# Altium project PLC光电隔离模块NPN-16路.PrjPcb
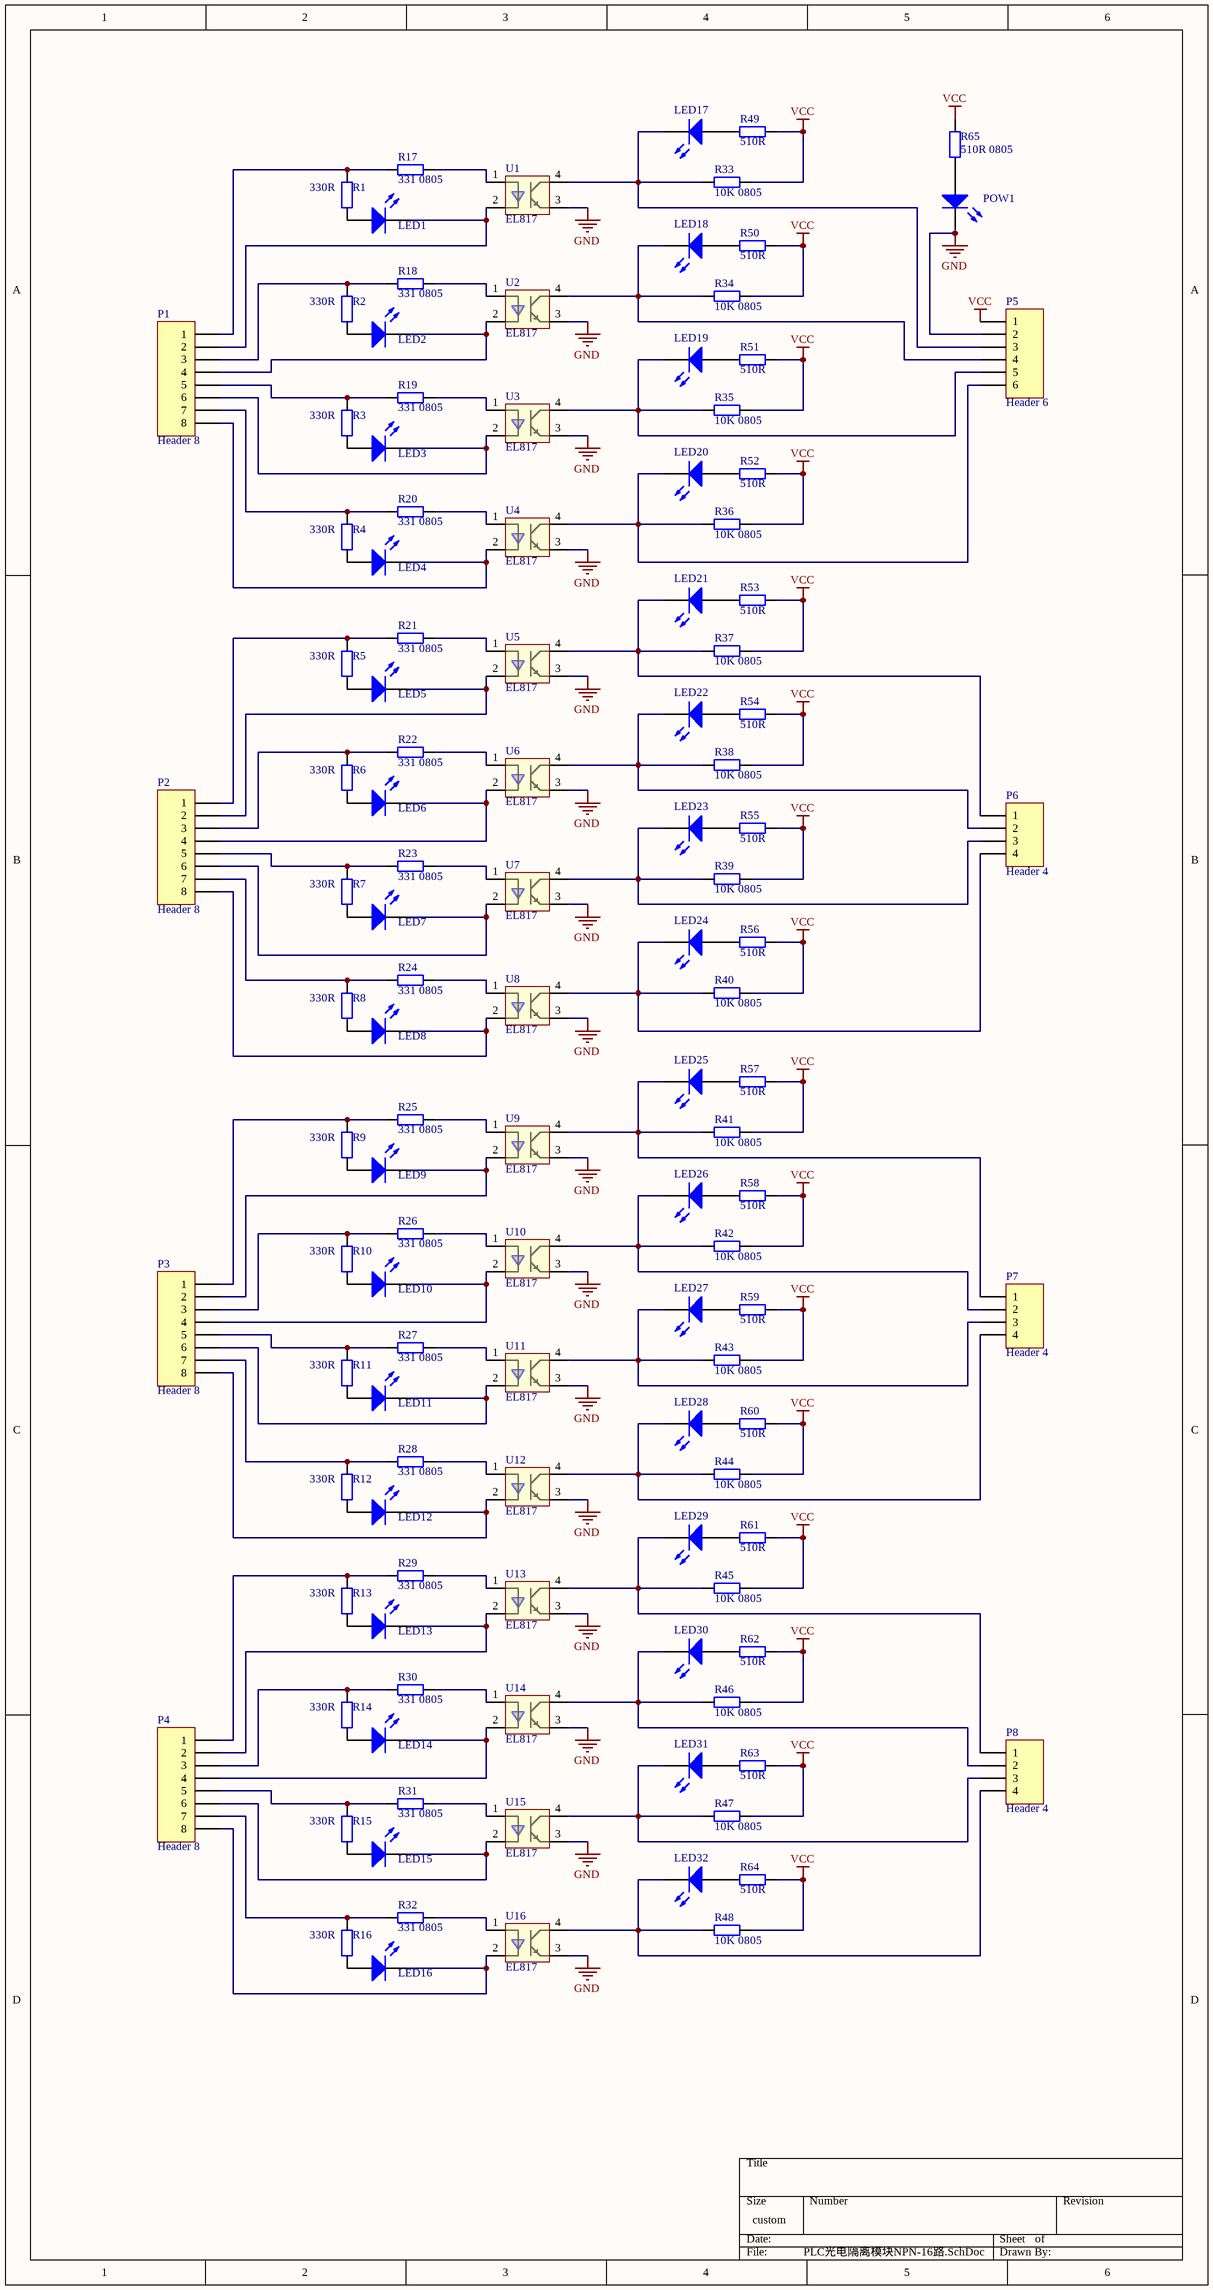
[diagram p0: PLC光电隔离模块NPN-16路.SchDoc]
1 sheet, 122 parts. Net scope: global (net labels, ports and power ports of the same name join across sheets).
Board file: PLC光电隔离模块NPN-16路.PcbDoc

## Sheet PLC光电隔离模块NPN-16路.SchDoc
size 241 x 457 mm

### Parts
LED1  0805  [LC-0805]  (value not drawn)
LED2  0805  [LC-0805]  (value not drawn)
LED3  0805  [LC-0805]  (value not drawn)
LED4  0805  [LC-0805]  (value not drawn)
LED5  0805  [LC-0805]  (value not drawn)
LED6  0805  [LC-0805]  (value not drawn)
LED7  0805  [LC-0805]  (value not drawn)
LED8  0805  [LC-0805]  (value not drawn)
LED9  0805  [LC-0805]  (value not drawn)
LED10  0805  [LC-0805]  (value not drawn)
LED11  0805  [LC-0805]  (value not drawn)
LED12  0805  [LC-0805]  (value not drawn)
LED13  0805  [LC-0805]  (value not drawn)
LED14  0805  [LC-0805]  (value not drawn)
LED15  0805  [LC-0805]  (value not drawn)
LED16  0805  [LC-0805]  (value not drawn)
LED17  0805  [LC-0805]  (value not drawn)
LED18  0805  [LC-0805]  (value not drawn)
LED19  0805  [LC-0805]  (value not drawn)
LED20  0805  [LC-0805]  (value not drawn)
LED21  0805  [LC-0805]  (value not drawn)
LED22  0805  [LC-0805]  (value not drawn)
LED23  0805  [LC-0805]  (value not drawn)
LED24  0805  [LC-0805]  (value not drawn)
LED25  0805  [LC-0805]  (value not drawn)
LED26  0805  [LC-0805]  (value not drawn)
LED27  0805  [LC-0805]  (value not drawn)
LED28  0805  [LC-0805]  (value not drawn)
LED29  0805  [LC-0805]  (value not drawn)
LED30  0805  [LC-0805]  (value not drawn)
LED31  0805  [LC-0805]  (value not drawn)
LED32  0805  [LC-0805]  (value not drawn)
P1  Header 8  [128单排8位端子5.08]
P2  Header 8  [128单排8位端子5.08]
P3  Header 8  [128单排8位端子5.08]
P4  Header 8  [128单排8位端子5.08]
P5  Header 6  [128单排6位端子5.08 - 反向]
P6  Header 4  [128单排4位端子5.08]
P7  Header 4  [128单排4位端子5.08]
P8  Header 4  [128单排4位端子5.08]
POW1  0805  [LC-0805]  (value not drawn)
R1  330R  [LC-0805_L]
R2  330R  [LC-0805_L]
R3  330R  [LC-0805_L]
R4  330R  [LC-0805_L]
R5  330R  [LC-0805_L]
R6  330R  [LC-0805_L]
R7  330R  [LC-0805_L]
R8  330R  [LC-0805_L]
R9  330R  [LC-0805_L]
R10  330R  [LC-0805_L]
R11  330R  [LC-0805_L]
R12  330R  [LC-0805_L]
R13  330R  [LC-0805_L]
R14  330R  [LC-0805_L]
R15  330R  [LC-0805_L]
R16  330R  [LC-0805_L]
R17  331 0805  [LC-0805_L]
R18  331 0805  [LC-0805_L]
R19  331 0805  [LC-0805_L]
R20  331 0805  [LC-0805_L]
R21  331 0805  [LC-0805_L]
R22  331 0805  [LC-0805_L]
R23  331 0805  [LC-0805_L]
R24  331 0805  [LC-0805_L]
R25  331 0805  [LC-0805_L]
R26  331 0805  [LC-0805_L]
R27  331 0805  [LC-0805_L]
R28  331 0805  [LC-0805_L]
R29  331 0805  [LC-0805_L]
R30  331 0805  [LC-0805_L]
R31  331 0805  [LC-0805_L]
R32  331 0805  [LC-0805_L]
R33  10K 0805  [LC-0805_L]
R34  10K 0805  [LC-0805_L]
R35  10K 0805  [LC-0805_L]
R36  10K 0805  [LC-0805_L]
R37  10K 0805  [LC-0805_L]
R38  10K 0805  [LC-0805_L]
R39  10K 0805  [LC-0805_L]
R40  10K 0805  [LC-0805_L]
R41  10K 0805  [LC-0805_L]
R42  10K 0805  [LC-0805_L]
R43  10K 0805  [LC-0805_L]
R44  10K 0805  [LC-0805_L]
R45  10K 0805  [LC-0805_L]
R46  10K 0805  [LC-0805_L]
R47  10K 0805  [LC-0805_L]
R48  10K 0805  [LC-0805_L]
R49  510R  [LC-0805_L]
R50  510R  [LC-0805_L]
R51  510R  [LC-0805_L]
R52  510R  [LC-0805_L]
R53  510R  [LC-0805_L]
R54  510R  [LC-0805_L]
R55  510R  [LC-0805_L]
R56  510R  [LC-0805_L]
R57  510R  [LC-0805_L]
R58  510R  [LC-0805_L]
R59  510R  [LC-0805_L]
R60  510R  [LC-0805_L]
R61  510R  [LC-0805_L]
R62  510R  [LC-0805_L]
R63  510R  [LC-0805_L]
R64  510R  [LC-0805_L]
R65  510R 0805  [LC-0805_L]
U1  EL817  [EL817]
U2  EL817  [EL817]
U3  EL817  [EL817]
U4  EL817  [EL817]
U5  EL817  [EL817]
U6  EL817  [EL817]
U7  EL817  [EL817]
U8  EL817  [EL817]
U9  EL817  [EL817]
U10  EL817  [EL817]
U11  EL817  [EL817]
U12  EL817  [EL817]
U13  EL817  [EL817]
U14  EL817  [EL817]
U15  EL817  [EL817]
U16  EL817  [EL817]

### Nets
GND: P5.2 POW1.2(K) U1.3 U2.3 U3.3 U4.3 U5.3 U6.3 U7.3 U8.3 U9.3 U10.3 U11.3 U12.3 U13.3 U14.3 U15.3 U16.3
VCC: P5.1 R33.2 R34.2 R35.2 R36.2 R37.2 R38.2 R39.2 R40.2 R41.2 R42.2 R43.2 R44.2 R45.2 R46.2 R47.2 R48.2 R49.1 R50.1 R51.1 R52.1 R53.1 R54.1 R55.1 R56.1 R57.1 R58.1 R59.1 R60.1 R61.1 R62.1 R63.1 R64.1 R65.2
NetLED1_1: LED1.1(A) R1.1
NetLED1_2: LED1.2(K) P1.2 U1.2
NetLED2_1: LED2.1(A) R2.1
NetLED2_2: LED2.2(K) P1.4 U2.2
NetLED3_1: LED3.1(A) R3.1
NetLED3_2: LED3.2(K) P1.6 U3.2
NetLED4_1: LED4.1(A) R4.1
NetLED4_2: LED4.2(K) P1.8 U4.2
NetLED5_1: LED5.1(A) R5.1
NetLED5_2: LED5.2(K) P2.2 U5.2
NetLED6_1: LED6.1(A) R6.1
NetLED6_2: LED6.2(K) P2.4 U6.2
NetLED7_1: LED7.1(A) R7.1
NetLED7_2: LED7.2(K) P2.6 U7.2
NetLED8_1: LED8.1(A) R8.1
NetLED8_2: LED8.2(K) P2.8 U8.2
NetLED9_1: LED9.1(A) R9.1
NetLED9_2: LED9.2(K) P3.2 U9.2
NetLED10_1: LED10.1(A) R10.1
NetLED10_2: LED10.2(K) P3.4 U10.2
NetLED11_1: LED11.1(A) R11.1
NetLED11_2: LED11.2(K) P3.6 U11.2
NetLED12_1: LED12.1(A) R12.1
NetLED12_2: LED12.2(K) P3.8 U12.2
NetLED13_1: LED13.1(A) R13.1
NetLED13_2: LED13.2(K) P4.2 U13.2
NetLED14_1: LED14.1(A) R14.1
NetLED14_2: LED14.2(K) P4.4 U14.2
NetLED15_1: LED15.1(A) R15.1
NetLED15_2: LED15.2(K) P4.6 U15.2
NetLED16_1: LED16.1(A) R16.1
NetLED16_2: LED16.2(K) P4.8 U16.2
NetLED17_1: LED17.1(A) R49.2
NetLED17_2: LED17.2(K) P5.3 R33.1 U1.4
NetLED18_1: LED18.1(A) R50.2
NetLED18_2: LED18.2(K) P5.4 R34.1 U2.4
NetLED19_1: LED19.1(A) R51.2
NetLED19_2: LED19.2(K) P5.5 R35.1 U3.4
NetLED20_1: LED20.1(A) R52.2
NetLED20_2: LED20.2(K) P5.6 R36.1 U4.4
NetLED21_1: LED21.1(A) R53.2
NetLED21_2: LED21.2(K) P6.1 R37.1 U5.4
NetLED22_1: LED22.1(A) R54.2
NetLED22_2: LED22.2(K) P6.2 R38.1 U6.4
NetLED23_1: LED23.1(A) R55.2
NetLED23_2: LED23.2(K) P6.3 R39.1 U7.4
NetLED24_1: LED24.1(A) R56.2
NetLED24_2: LED24.2(K) P6.4 R40.1 U8.4
NetLED25_1: LED25.1(A) R57.2
NetLED25_2: LED25.2(K) P7.1 R41.1 U9.4
NetLED26_1: LED26.1(A) R58.2
NetLED26_2: LED26.2(K) P7.2 R42.1 U10.4
NetLED27_1: LED27.1(A) R59.2
NetLED27_2: LED27.2(K) P7.3 R43.1 U11.4
NetLED28_1: LED28.1(A) R60.2
NetLED28_2: LED28.2(K) P7.4 R44.1 U12.4
NetLED29_1: LED29.1(A) R61.2
NetLED29_2: LED29.2(K) P8.1 R45.1 U13.4
NetLED30_1: LED30.1(A) R62.2
NetLED30_2: LED30.2(K) P8.2 R46.1 U14.4
NetLED31_1: LED31.1(A) R63.2
NetLED31_2: LED31.2(K) P8.3 R47.1 U15.4
NetLED32_1: LED32.1(A) R64.2
NetLED32_2: LED32.2(K) P8.4 R48.1 U16.4
NetP1_1: P1.1 R1.2 R17.1
NetP1_3: P1.3 R2.2 R18.1
NetP1_5: P1.5 R3.2 R19.1
NetP1_7: P1.7 R4.2 R20.1
NetP2_1: P2.1 R5.2 R21.1
NetP2_3: P2.3 R6.2 R22.1
NetP2_5: P2.5 R7.2 R23.1
NetP2_7: P2.7 R8.2 R24.1
NetP3_1: P3.1 R9.2 R25.1
NetP3_3: P3.3 R10.2 R26.1
NetP3_5: P3.5 R11.2 R27.1
NetP3_7: P3.7 R12.2 R28.1
NetP4_1: P4.1 R13.2 R29.1
NetP4_3: P4.3 R14.2 R30.1
NetP4_5: P4.5 R15.2 R31.1
NetP4_7: P4.7 R16.2 R32.1
NetPOW1_1: POW1.1(A) R65.1
NetR17_2: R17.2 U1.1
NetR18_2: R18.2 U2.1
NetR19_2: R19.2 U3.1
NetR20_2: R20.2 U4.1
NetR21_2: R21.2 U5.1
NetR22_2: R22.2 U6.1
NetR23_2: R23.2 U7.1
NetR24_2: R24.2 U8.1
NetR25_2: R25.2 U9.1
NetR26_2: R26.2 U10.1
NetR27_2: R27.2 U11.1
NetR28_2: R28.2 U12.1
NetR29_2: R29.2 U13.1
NetR30_2: R30.2 U14.1
NetR31_2: R31.2 U15.1
NetR32_2: R32.2 U16.1

### Library data of the parts
LED1-LED32 POW1 = LED0: Typical INFRARED GaAs LED; Published: 8-Jun-2000; LatestRevisionDate: 08-Jul-2005; LatestRevisionNote: Mech Layer 1 removed.; PackageReference: LED-0; Publisher: Altium Limited; PackageDescription: LED; 2 Leads
P1-P4 = Header 8: Header, 8-Pin; LatestRevisionDate: 17-Jul-2002; LatestRevisionNote: Re-released for DXP Platform.; Publisher: Altium Limited
P5 = Header 6: Header, 6-Pin; LatestRevisionDate: 17-Jul-2002; LatestRevisionNote: Re-released for DXP Platform.; Publisher: Altium Limited
P6-P8 = Header 4: Header, 4-Pin; LatestRevisionDate: 17-Jul-2002; LatestRevisionNote: Re-released for DXP Platform.; Publisher: Altium Limited
R1-R65 = Res2: Resistor; Value: 1K; Published: 8-Jun-2000; LatestRevisionDate: 17-Jul-2002; LatestRevisionNote: Re-released for DXP Platform.; PackageReference: AXIAL-0.4; Publisher: Altium Limited; PackageDescription: Axial Device, Thru-Hole; 2 Leads; 0.4 in Pin Spacing